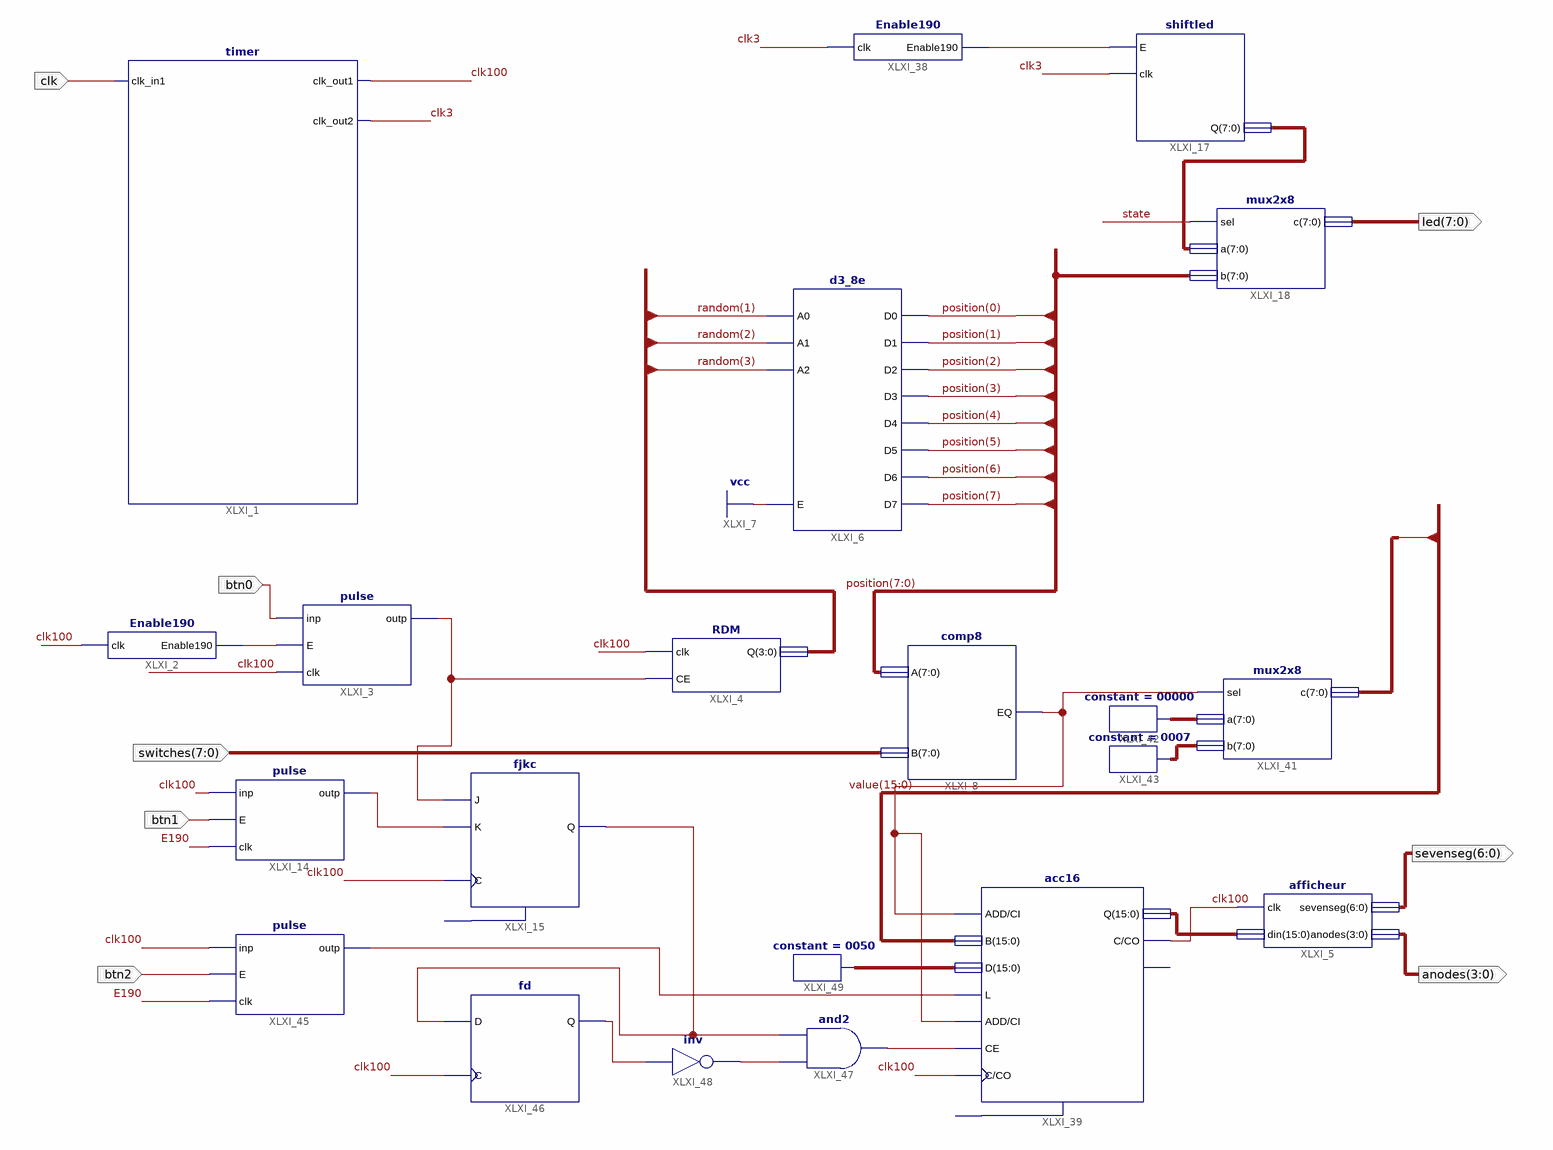
[diagram p0: schematic sheet 1]
// Xilinx ISE schematic toplevel2.sch (spartan6) as structural Verilog: 21 symbols, 8 ports
module toplevel2 (
  input  clk,
  input  [7:0] switches,
  input  btn0,
  input  btn1,
  input  btn2,
  output [7:0] led,
  output [6:0] sevenseg,
  output [3:0] anodes
);

  wire clk3, clk100, E190, state, XLXN_7, XLXN_10, XLXN_37, XLXN_140, XLXN_154, XLXN_173, XLXN_175, XLXN_178,
       XLXN_179, XLXN_184;
  wire [3:0] random;
  wire [7:0] position, XLXN_119, XLXN_148, XLXN_150;
  wire [15:0] value, XLXN_143, XLXN_185;

  timer XLXI_1 (.clk_in1(clk), .clk_out1(clk100), .clk_out2(clk3));
  comp8 XLXI_8 (.A(position), .B(switches), .EQ(XLXN_154));
  Enable190 XLXI_2 (.clk(clk100), .Enable190(XLXN_7));
  fjkc XLXI_15 (.C(clk100), .J(XLXN_10), .K(XLXN_37), .Q(XLXN_184));  // open: CLR
  pulse XLXI_3 (.inp(btn0), .E(XLXN_7), .clk(clk100), .outp(XLXN_10));
  RDM XLXI_4 (.clk(clk100), .CE(XLXN_10), .Q(random));
  shiftled XLXI_17 (.E(XLXN_140), .clk(clk3), .Q(XLXN_119));
  mux2x8 XLXI_18 (.sel(state), .a(XLXN_119), .b(position), .c(led));
  d3_8e XLXI_6 (
    .A0(random[1]), .A1(random[2]), .A2(random[3]), .E(1'b1), .D0(position[0]), .D1(position[1]),
    .D2(position[2]), .D3(position[3]), .D4(position[4]), .D5(position[5]), .D6(position[6]), .D7(position[7]));
  Enable190 XLXI_38 (.clk(clk3), .Enable190(XLXN_140));
  acc16 XLXI_39 (
    .ADD(XLXN_154), .B(value), .C(clk100), .CE(XLXN_175), .CI(XLXN_154), .D(XLXN_185), .L(XLXN_173),
    .CO(clk100), .Q(XLXN_143));  // open: R, OFL
  afficheur XLXI_5 (.clk(clk100), .din(XLXN_143), .sevenseg(sevenseg), .anodes(anodes));
  pulse XLXI_14 (.inp(clk100), .E(btn1), .clk(E190), .outp(XLXN_37));
  pulse XLXI_45 (.inp(clk100), .E(btn2), .clk(E190), .outp(XLXN_173));
  fd XLXI_46 (.C(clk100), .D(XLXN_184), .Q(XLXN_178));
  and XLXI_47 (XLXN_175, XLXN_179, XLXN_184);
  not XLXI_48 (XLXN_179, XLXN_178);
  constant #(.CValue("0050")) XLXI_49 (.O(XLXN_185));
  constant #(.CValue("0007")) XLXI_43 (.O(XLXN_150));
  constant #(.CValue("00000")) XLXI_42 (.O(XLXN_148));
  mux2x8 XLXI_41 (.sel(XLXN_154), .a(XLXN_148), .b(XLXN_150), .c(value[7:0]));
endmodule
